# EAGLE design PCM1794_DAC_Breakout (EAGLE 6.4)
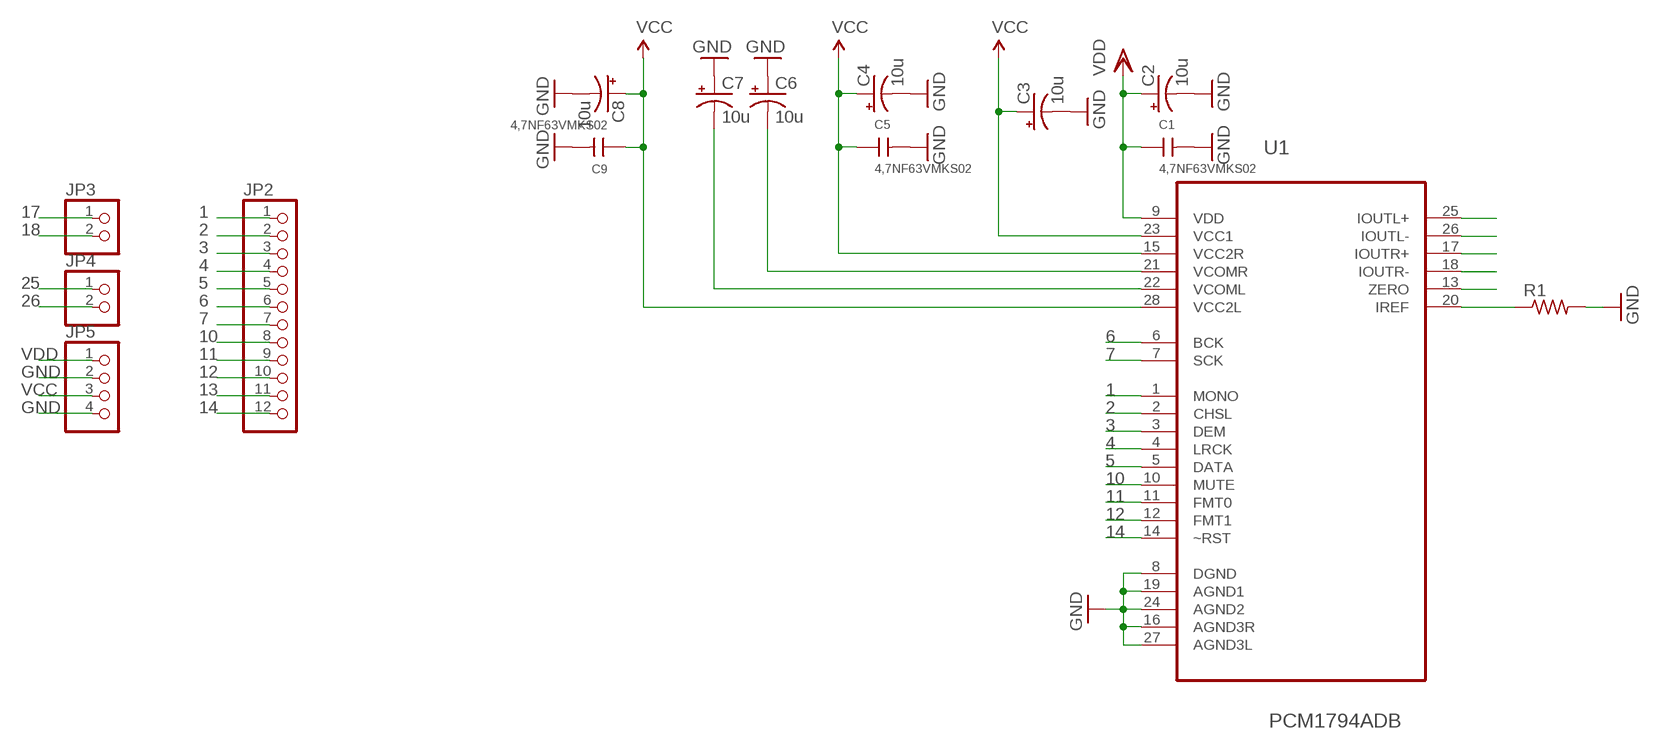
[diagram p0: schematic, sheet 1]

## Parts
C1  4,7NF63VMKS02  [2,5X7,0RM2,5]
C2  10u  CPOL-USE2.5-6  [E2,5-6]
C3  10u  CPOL-USE2.5-6  [E2,5-6]
C4  10u  CPOL-USE2.5-6  [E2,5-6]
C5  4,7NF63VMKS02  [2,5X7,0RM2,5]
C6  10u  CPOL-USE2.5-6  [E2,5-6]
C7  10u  CPOL-USE2.5-6  [E2,5-6]
C8  10u  CPOL-USE2.5-6  [E2,5-6]
C9  4,7NF63VMKS02  [2,5X7,0RM2,5]
JP2  PINHD-1X12  [1X12]
JP3  PINHD-1X2  [1X02]
JP4  PINHD-1X2  [1X02]
JP5  PINHD-1X4  [1X04]
R1  R-US_R0603  [R0603]
U1  PCM1794ADB  [SOP65P780X200-28N]

## Nets
1: JP2.1 U1.1(MONO)
2: JP2.2 U1.2(CHSL)
3: JP2.3 U1.3(DEM)
4: JP2.4 U1.4(LRCK)
5: JP2.5 U1.5(DATA)
6: JP2.6 U1.6(BCK)
7: JP2.7 U1.7(SCK)
10: JP2.8 U1.10(MUTE)
11: JP2.9 U1.11(FMT0)
12: JP2.10 U1.12(FMT1)
13: JP2.11 U1.13(ZERO)
14: JP2.12 U1.14(~RST)
17: JP3.1 U1.17(IOUTR+)
18: JP3.2 U1.18(IOUTR-)
20: R1.1 U1.20(IREF)
25: JP4.1 U1.25(IOUTL+)
26: JP4.2 U1.26(IOUTL-)
GND: C1.2 C2.- C3.- C4.- C5.2 C6.+ C7.+ C8.- C9.2 JP5.2 JP5.4 R1.2 U1.8(DGND) U1.16(AGND3R) U1.19(AGND1) U1.24(AGND2) U1.27(AGND3L)
N$49: C6.- U1.21(VCOMR)
N$50: C7.- U1.22(VCOML)
VCC: C3.+ C4.+ C5.1 C8.+ C9.1 JP5.3 U1.15(VCC2R) U1.23(VCC1) U1.28(VCC2L)
VDD: C1.1 C2.+ JP5.1 U1.9(VDD)

## Library data of the parts
C1 C5 C9 = wima_c:4,7NF63V
C2-C4 C6-C8 = rcl:CPOL-US: POLARIZED CAPACITOR, American symbol
JP2 = pinhead_no_text:PINHD-1X12: PIN HEADER
JP3 JP4 = pinhead_no_text:PINHD-1X2: PIN HEADER
JP5 = pinhead_no_text:PINHD-1X4: PIN HEADER
R1 = rcl:R-US_: RESISTOR, American symbol
U1 = Texas Instruments_By_element14_Batch_1:PCM1794ADB: 24-Bit 192khz Sampling advanced segment Audio stereo digital-to-analog converter; MPN: PCM1794ADB; OC_FARNELL: 1755014; OC_NEWARK: 54K0199; PACKAGE: SSOP-28; SUPPLIER: Texas Instruments

## Board
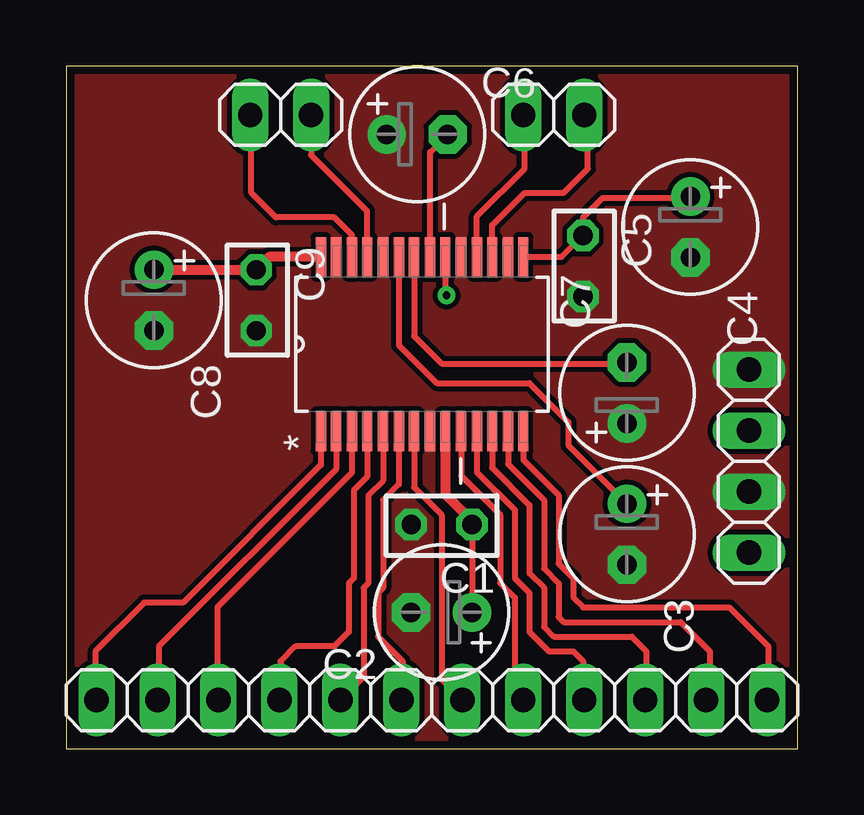
[diagram p1: board, top side]
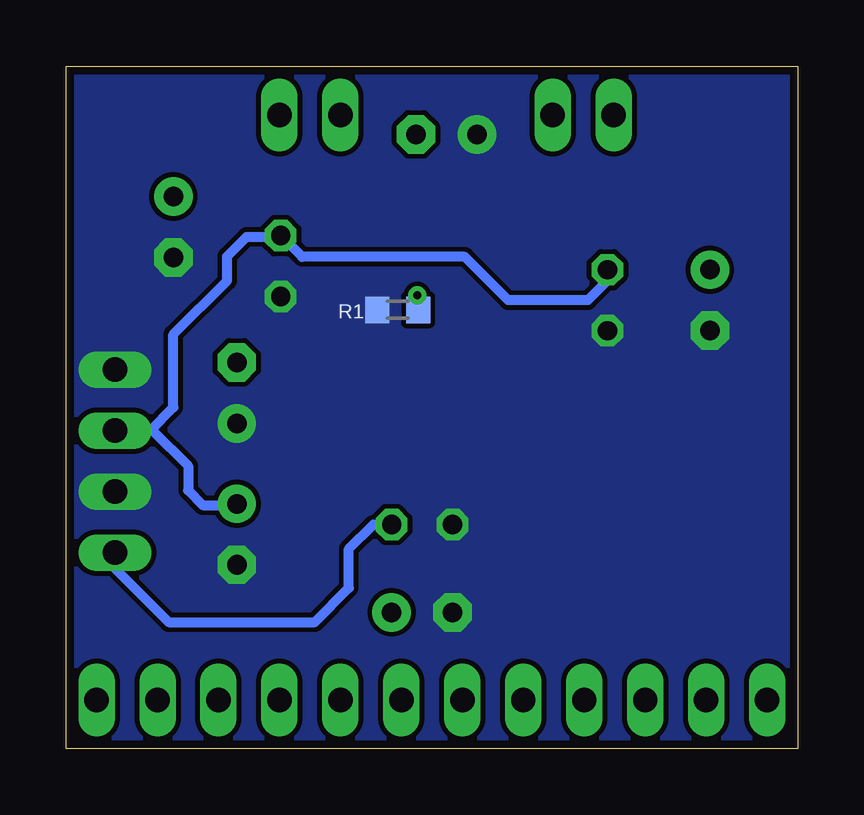
[diagram p2: board, bottom side, seen from below]

Size 30.48 x 28.45 mm. Coordinates in mm from the lower left corner, seen from the top.
Outline: 0,0 30.48,0 30.48,28.45 0,28.45 0,0
Copper layers (1*16): Top 0.035mm / dielectric 1.5mm / Bottom 0.035mm
Design rules "default *": minimum track width 8mil, minimum drill 24mil, track to track 8mil, track to pad 8mil, pad to pad 8mil, via to via 8mil, smd to smd 8mil, copper to edge 13mil, drill to drill 8mil, minimum pad ring 10mil, minimum via ring 8mil, stop-mask expansion 4mil, vias tented up to drill 14mil, thermal gap 10mil

### Footprints (pad centres in the part's own frame; a part is rotated, then mirrored left to right if it is on the bottom)
2,5X7,0RM2,5 = drill 0.8 pad 1.3 octagon: 1 -1.27,0; 2 1.27,0
E2,5-6 = drill 0.813 pad 1.6: + -1.27,0 | drill 0.813 pad 1.6 octagon: - 1.27,0
1X12 = drill 1.016 long: 1 -13.97,0; 2 -11.43,0; 3 -8.89,0; 4 -6.35,0; 5 -3.81,0; 6 -1.27,0; 7 1.27,0; 8 3.81,0; 9 6.35,0; 10 8.89,0; 11 11.43,0; 12 13.97,0
1X02 = drill 1.016 long: 1 -1.27,0; 2 1.27,0
1X04 = drill 1.016 long: 1 -3.81,0; 2 -1.27,0; 3 1.27,0; 4 3.81,0
R0603 = smd 1 x 1.1: 1 -0.85,0; 2 0.85,0
SOP65P780X200-28N = smd 1.651 x 0.432: 1 -3.632,4.216; 2 -3.632,3.581; 3 -3.632,2.921; 4 -3.632,2.286; 5 -3.632,1.626; 6 -3.632,0.965; 7 -3.632,0.33; 8 -3.632,-0.33; 9 -3.632,-0.965; 10 -3.632,-1.626; 11 -3.632,-2.286; 12 -3.632,-2.921; 13 -3.632,-3.581; 14 -3.632,-4.216; 15 3.632,-4.216; 16 3.632,-3.581; 17 3.632,-2.921; 18 3.632,-2.286; 19 3.632,-1.626; 20 3.632,-0.965; 21 3.632,-0.33; 22 3.632,0.33; 23 3.632,0.965; 24 3.632,1.626; 25 3.632,2.286; 26 3.632,2.921; 27 3.632,3.581; 28 3.632,4.216

### Placement (x,y rotation side)
C1  15.65,9.35 180 top
C2  15.65,5.69 180 top
C3  23.37,8.94 270 top
C4  26.01,21.74 270 top
C5  21.54,20.12 270 top
C6  14.63,25.6 0 top
C7  23.37,14.83 90 top
C8  3.66,18.69 270 top
C9  7.92,18.69 270 top
JP2  15.24,2.03 0 top
JP3  20.32,26.42 180 top
JP4  8.94,26.42 180 top
JP5  28.45,11.99 90 top
R1  16.66,18.29 180 bottom
U1  14.83,16.87 90 top

### Tracks (layer width: path | path; a pad name or v marks a point on that pad's centre or on a via)
1
  Top 0.254: U1.1 10.62,11.84 4.88,6.1 3.25,6.1 1.22,4.06 1.22,2.08 JP2.1
2
  Top 0.254: U1.2 11.25,11.66 3.86,4.27 3.86,2.08 JP2.2
3
  Top 0.254: U1.3 11.91,11.51 6.3,5.89 6.3,2.08 JP2.3
4
  Top 0.254: U1.4 12.55,11.33 11.99,10.77 11.99,7.11 11.79,6.91 11.79,4.88 11.18,4.27 9.55,4.27 8.94,3.66 8.94,2.08 JP2.4
5
  Top 0.254: U1.5 13.21,11.18 12.6,10.57 12.6,6.91 12.4,6.71 12.4,3 JP2.5
6
  Top 0.254: U1.6 13.87,11.02 13.21,10.36 13.21,6.71 13.01,6.5 13.01,4.67 14.02,3.66 14.02,2.08 JP2.6
7
  Top 0.254: U1.7 14.5,10.9 15.65,9.75 15.65,2.9 JP2.7
10
  Top 0.254: U1.10 16.46,11.38 18.09,9.75 18.09,6.91 18.69,6.3 18.69,2.39 JP2.8
11
  Top 0.254: U1.11 17.12,11.53 18.69,9.96 18.69,7.11 19.3,6.5 19.3,4.88 20.12,4.06 21.13,4.06 21.54,3.66 21.54,2.08 JP2.9
12
  Top 0.254: U1.12 17.76,11.71 19.3,10.16 19.3,7.32 19.91,6.71 19.91,5.08 20.32,4.67 23.57,4.67 24.18,4.06 24.18,2.08 JP2.10
13
  Top 0.254: U1.13 18.42,11.86 19.91,10.36 19.91,7.52 20.52,6.91 20.52,5.49 20.73,5.28 25.6,5.28 26.82,4.06 26.82,2.18 JP2.11
14
  Top 0.254: U1.14 19.05,12.04 20.52,10.57 20.52,7.72 21.13,7.11 21.13,6.3 21.54,5.89 27.64,5.89 29.26,4.27 29.26,2.08 JP2.12
17
  Top 0.254: U1.17 17.76,21.82 19.1,23.16 20.73,23.16 21.74,24.18 21.74,26.26 JP3.1
18
  Top 0.254: U1.18 17.12,22.2 19.1,24.18 19.1,26.37 JP3.2
20  (via drill 0.33)
  Top 0.254: U1.20 15.8,18.95 v15.85,18.9
  Bottom 0.254: R1.1 15.81,18.86 v15.85,18.9
25
  Top 0.254: U1.25 12.55,22.4 10.21,24.74 JP4.1
26
  Top 0.254: U1.26 11.91,21.41 11.18,22.15 8.74,22.15 7.72,23.16 7.72,26.37 JP4.2
GND
  pour Bottom (rank 6, no thermals): 0.41,28.04 30.07,28.04 30.07,0.41 0.41,0.41
  pour Top (rank 6, no thermals): 0.41,28.04 30.07,28.04 30.07,0.61 30.07,0.41 0.41,0.41
N$49
  Top 0.254: U1.21 15.16,24.87 C6.-
N$50
  Top 0.254: U1.22 14.5,17.2 15.65,16.05 23.32,16.05 C7.-
VCC
  Top 0.254: U1.23 13.87,16.81 15.44,15.24 19.3,15.24 20.93,13.61 20.93,12.65 C3.+ | U1.15 20.65,20.5 C5.1 21.54,22.15 22.35,22.96 25.96,22.96 C4.+
  Top 0.406: U1.28 8.46,20.5 C9.1 C8.+
  Bottom 0.406: JP5.3 26.98,13.26 | 26.98,13.26 26.01,14.22 26.01,17.27 23.77,19.51 23.77,20.52 22.96,21.34 21.59,21.34 C5.1 20.65,20.5 U1.23 12.06,18.69 8.74,18.69 7.93,19.51 C9.1 | 26.98,13.26 26.87,13.26 25.4,11.79 25.4,10.77 24.79,10.16 23.42,10.16 C3.+
VDD
  Top 0.254: C1.1 C2.+
  Top 0.406: U1.9 15.8,10.62 16.66,9.75 16.66,9.6 C1.1
  Bottom 0.406: JP5.1 28.45,7.52 26.21,5.28 20.12,5.28 18.69,6.71 18.69,8.33 17.68,9.35 C1.1